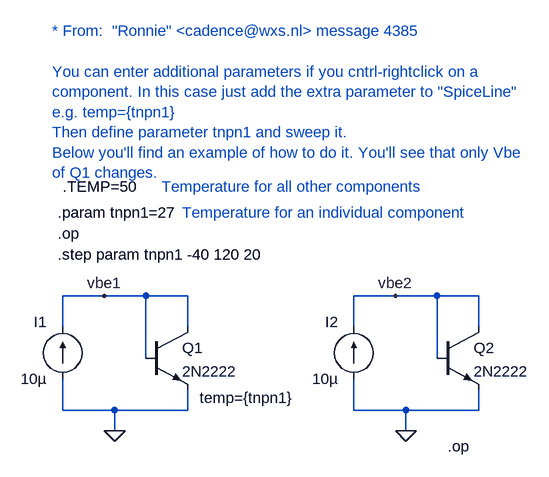
[diagram p0: schematic individual_temp.asc]
individual_temp.asc, the LTspice schematic file:
Version 4
SHEET 1 880 680
WIRE -16 192 -16 144
WIRE -16 320 -16 272
WIRE 48 144 -16 144
WIRE 64 320 -16 320
WIRE 64 352 64 320
WIRE 112 144 48 144
WIRE 112 240 112 144
WIRE 176 144 112 144
WIRE 176 192 176 144
WIRE 176 320 64 320
WIRE 176 320 176 288
WIRE 432 192 432 144
WIRE 432 320 432 272
WIRE 496 144 432 144
WIRE 512 320 432 320
WIRE 512 352 512 320
WIRE 560 144 496 144
WIRE 560 240 560 144
WIRE 624 144 560 144
WIRE 624 192 624 144
WIRE 624 320 512 320
WIRE 624 320 624 288
FLAG 64 352 0
FLAG 512 352 0
FLAG 48 144 vbe1
FLAG 496 144 vbe2
SYMBOL npn 112 192 R0
WINDOW 39 83 109 Left 0
SYMATTR SpiceLine temp={tnpn1}
SYMATTR InstName Q1
SYMATTR Value 2N2222
SYMBOL current -16 272 R180
WINDOW 0 24 88 Left 0
WINDOW 3 24 0 Left 0
WINDOW 123 0 0 Left 0
WINDOW 39 0 0 Left 0
SYMATTR InstName I1
SYMATTR Value 10µ
SYMBOL npn 560 192 R0
SYMATTR InstName Q2
SYMATTR Value 2N2222
SYMBOL current 432 272 R180
WINDOW 0 24 88 Left 0
WINDOW 3 24 0 Left 0
WINDOW 123 0 0 Left 0
WINDOW 39 0 0 Left 0
SYMATTR InstName I2
SYMATTR Value 10µ
TEXT -24 48 Left 0 !.op
TEXT 576 376 Left 0 !.op
TEXT -24 80 Left 0 !.step param tnpn1 -40 120 20
TEXT -24 16 Left 0 !.param tnpn1=27
TEXT -32 -264 Left 0 ;* From:  "Ronnie" <cadence@wxs.nl> message 4385\n \nYou can enter additional parameters if you cntrl-rightclick on a\ncomponent. In this case just add the extra parameter to "SpiceLine"\ne.g. temp={tnpn1}\nThen define parameter tnpn1 and sweep it.\nBelow you'll find an example of how to do it. You'll see that only Vbe\nof Q1 changes.
TEXT -16 -24 Left 0 !.TEMP=50
TEXT 136 -24 Left 0 ;Temperature for all other components
TEXT 168 16 Left 0 ;Temperature for an individual component

The netlist it stands for:
* individual_temp.asc
Q1 vbe1 vbe1 0 0 2N2222 temp={tnpn1}
I1 0 vbe1 10µ
Q2 vbe2 vbe2 0 0 2N2222
I2 0 vbe2 10µ
.model NPN NPN
.model PNP PNP
.lib standard.bjt
.op
.op
.step param tnpn1 -40 120 20
.param tnpn1=27
* * From:  "Ronnie" <cadence@wxs.nl> message 4385
* You can enter additional parameters if you cntrl-rightclick on a
* component. In this case just add the extra parameter to "SpiceLine"
* e.g. temp={tnpn1}
* Then define parameter tnpn1 and sweep it.
* Below you'll find an example of how to do it. You'll see that only Vbe
* of Q1 changes.
.TEMP=50
* Temperature for all other components
* Temperature for an individual component
.backanno
.end